# EAGLE schematic LED_Circuit (EAGLE 6.5.0)
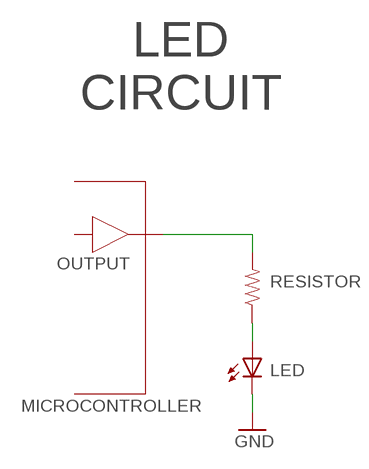
[diagram p0: schematic, sheet 1]

## Parts
LED  LED5MM  [LED5MM]
RESISTOR  RESISTORPTH-1/6W  [1/6W-RES]

## Nets
GND: LED.K(C)
N$1: RESISTOR.2
N$2: LED.A RESISTOR.1

## Notes on the sheet
- LED
  CIRCUIT
- OUTPUT
- MICROCONTROLLER

## Library data of the parts
LED = SparkFun-LED:LED: LEDs Standard schematic elements and footprints for 5mm, 3mm, 1206, and 0603 sized LEDs. 5mm - Spark Fun Electronics SKU : COM-00529 (and others)
RESISTOR = SparkFun-Resistors:RESISTOR: Resistor Basic schematic elements and footprints for 0603, 1206, and PTH resistors.